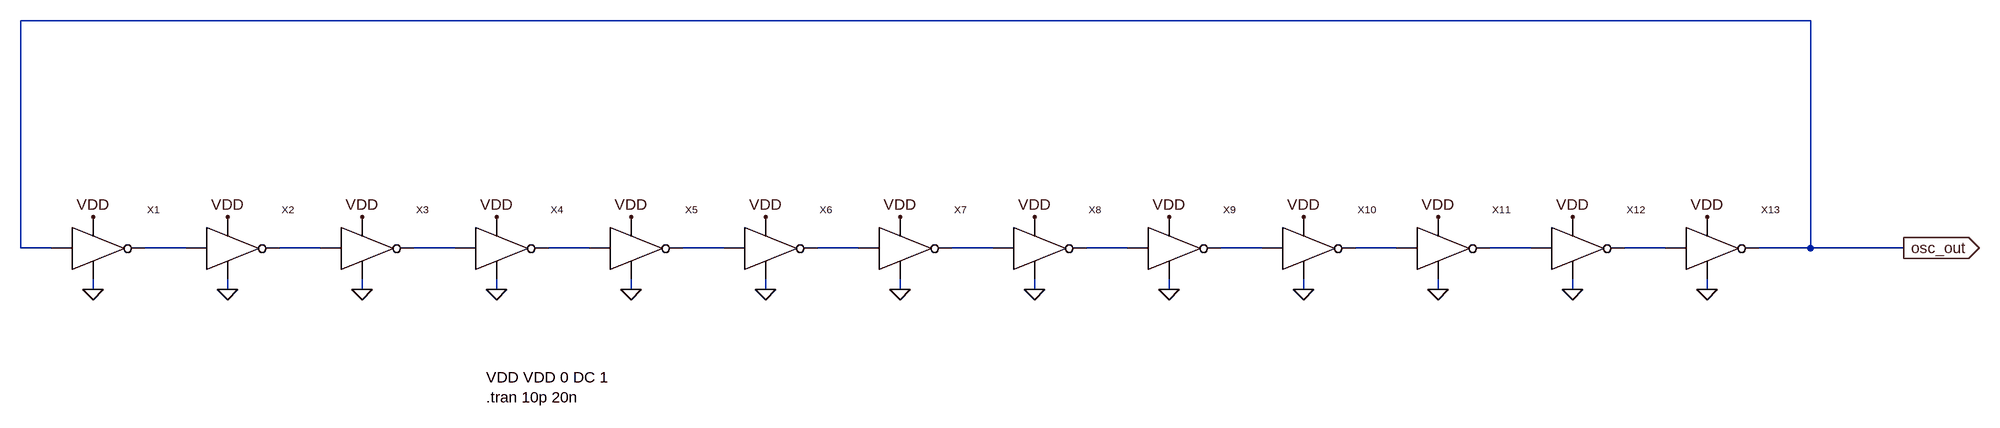
[diagram p0: schematic Draft2.asc]
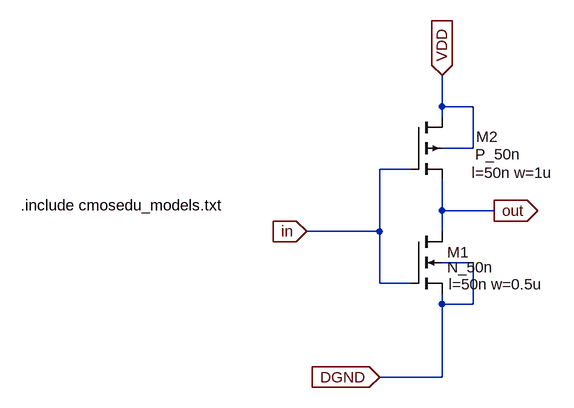
[diagram p1: sub-circuit inverter.asc]
Draft2.asc, the LTspice schematic file:
Version 4
SHEET 1 3064 680
WIRE 2768 -176 0 -176
WIRE 0 176 0 -176
WIRE 48 176 0 176
WIRE 256 176 192 176
WIRE 464 176 400 176
WIRE 672 176 608 176
WIRE 880 176 816 176
WIRE 1088 176 1024 176
WIRE 1296 176 1232 176
WIRE 1504 176 1440 176
WIRE 1712 176 1648 176
WIRE 1920 176 1856 176
WIRE 2128 176 2064 176
WIRE 2336 176 2272 176
WIRE 2544 176 2480 176
WIRE 2768 176 2768 -176
WIRE 2768 176 2688 176
WIRE 2912 176 2768 176
WIRE 112 240 112 224
WIRE 320 240 320 224
WIRE 528 240 528 224
WIRE 736 240 736 224
WIRE 944 240 944 224
WIRE 1152 240 1152 224
WIRE 1360 240 1360 224
WIRE 1568 240 1568 224
WIRE 1776 240 1776 224
WIRE 1984 240 1984 224
WIRE 2192 240 2192 224
WIRE 2400 240 2400 224
WIRE 2608 240 2608 224
FLAG 112 240 0
FLAG 112 128 VDD
FLAG 320 240 0
FLAG 320 128 VDD
FLAG 528 240 0
FLAG 528 128 VDD
FLAG 736 240 0
FLAG 736 128 VDD
FLAG 944 240 0
FLAG 944 128 VDD
FLAG 1152 240 0
FLAG 1152 128 VDD
FLAG 1360 240 0
FLAG 1360 128 VDD
FLAG 1568 240 0
FLAG 1568 128 VDD
FLAG 1776 240 0
FLAG 1776 128 VDD
FLAG 1984 240 0
FLAG 1984 128 VDD
FLAG 2192 240 0
FLAG 2192 128 VDD
FLAG 2400 240 0
FLAG 2400 128 VDD
FLAG 2608 240 0
FLAG 2608 128 VDD
FLAG 2912 176 osc_out
IOPIN 2912 176 Out
SYMBOL inverter 80 176 R0
SYMATTR InstName X1
SYMBOL inverter 288 176 R0
SYMATTR InstName X2
SYMBOL inverter 496 176 R0
SYMATTR InstName X3
SYMBOL inverter 704 176 R0
SYMATTR InstName X4
SYMBOL inverter 912 176 R0
SYMATTR InstName X5
SYMBOL inverter 1120 176 R0
SYMATTR InstName X6
SYMBOL inverter 1328 176 R0
SYMATTR InstName X7
SYMBOL inverter 1536 176 R0
SYMATTR InstName X8
SYMBOL inverter 1744 176 R0
SYMATTR InstName X9
SYMBOL inverter 1952 176 R0
SYMATTR InstName X10
SYMBOL inverter 2160 176 R0
SYMATTR InstName X11
SYMBOL inverter 2368 176 R0
SYMATTR InstName X12
SYMBOL inverter 2576 176 R0
SYMATTR InstName X13
TEXT 720 376 Left 2 !VDD VDD 0 DC 1\n.tran 10p 20n

inverter.asc, the sub-circuit schematic file:
Version 4
SHEET 1 880 680
WIRE 176 -32 176 -80
WIRE 224 -32 176 -32
WIRE 176 -16 176 -32
WIRE 224 32 224 -32
WIRE 224 32 176 32
WIRE 128 64 80 64
WIRE 176 128 176 80
WIRE 256 128 176 128
WIRE 80 160 80 64
WIRE 80 160 -32 160
WIRE 176 160 176 128
WIRE 224 208 176 208
WIRE 80 240 80 160
WIRE 128 240 80 240
WIRE 176 272 176 256
WIRE 224 272 224 208
WIRE 224 272 176 272
WIRE 176 384 176 272
WIRE 176 384 80 384
FLAG 176 -80 VDD
IOPIN 176 -80 In
FLAG -32 160 in
IOPIN -32 160 In
FLAG 256 128 out
IOPIN 256 128 Out
FLAG 80 384 DGND
IOPIN 80 384 In
SYMBOL nmos4 128 160 R0
WINDOW 3 56 55 Left 2
WINDOW 123 58 81 Left 2
SYMATTR Value N_50n
SYMATTR Value2 l=50n w=0.5u
SYMATTR InstName M1
SYMBOL pmos4 128 -16 R0
WINDOW 0 101 30 Left 2
WINDOW 3 99 57 Left 2
WINDOW 123 94 86 Left 2
SYMATTR InstName M2
SYMATTR Value P_50n
SYMATTR Value2 l=50n w=1u
TEXT -472 120 Left 2 !.include cmosedu_models.txt

The netlist it stands for:
* Draft2.asc
XX1 osc_out N001 VDD 0 inverter
XX2 N001 N002 VDD 0 inverter
XX3 N002 N003 VDD 0 inverter
XX4 N003 N004 VDD 0 inverter
XX5 N004 N005 VDD 0 inverter
XX6 N005 N006 VDD 0 inverter
XX7 N006 N007 VDD 0 inverter
XX8 N007 N008 VDD 0 inverter
XX9 N008 N009 VDD 0 inverter
XX10 N009 N010 VDD 0 inverter
XX11 N010 N011 VDD 0 inverter
XX12 N011 N012 VDD 0 inverter
XX13 N012 osc_out VDD 0 inverter

* block symbol definitions
.subckt inverter in out VDD DGND
M1 out in DGND DGND N_50n l=50n w=0.5u
M2 VDD in out VDD P_50n l=50n w=1u
.include cmosedu_models.txt
.ends inverter

.model NMOS NMOS
.model PMOS PMOS
.lib standard.mos
VDD VDD 0 DC 1
.tran 10p 20n
.backanno
.end